# Altium schematic sheet DCPBoard.SchDoc: Digital Control Power Board for MiCore
size A4; DrawnBy: eleqian; Revision: 1.0; SheetNumber: 1; SheetTotal: 1
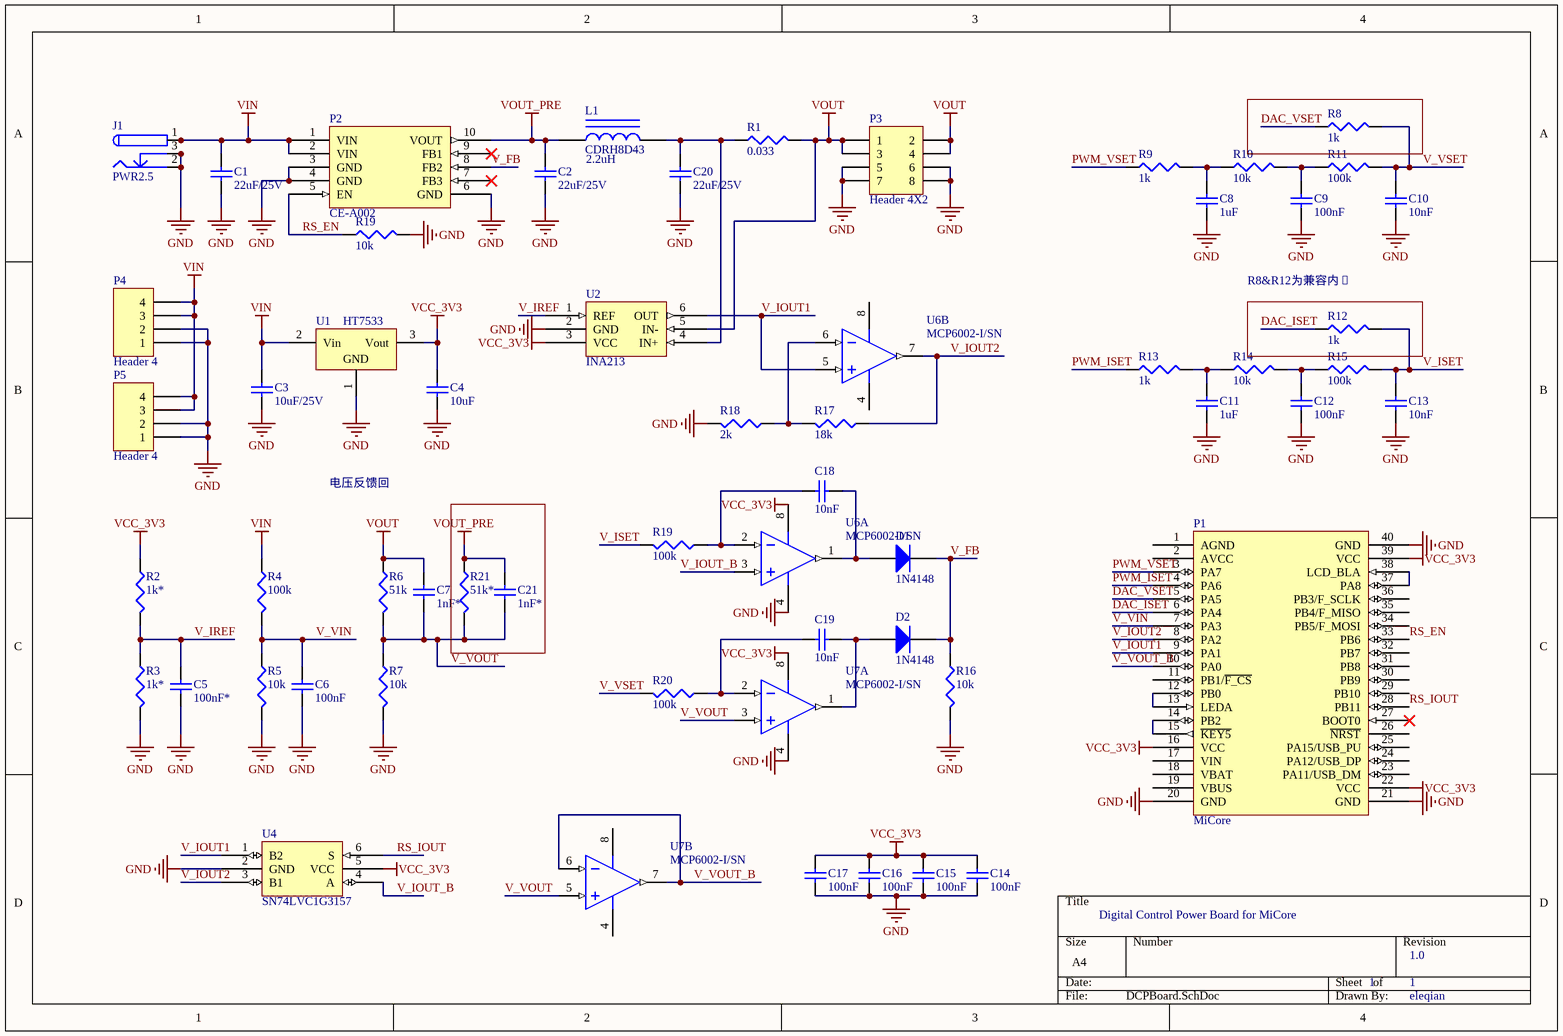
[diagram p0: DCPBoard.SchDoc]

## Parts
(Parts that share a designator on the sheet are numbered #1, #2 ... from top to bottom, then left to right.)
C1  value 22uF/25V  [1210C]  (hidden comment: Cap)
C2  value 22uF/25V  [1210C]  (hidden comment: Cap)
C3  value 10uF/25V  [1206C]  (hidden comment: Cap)
C4  value 10uF  [0805C]  (hidden comment: Cap)
C5  value 100nF*  [0603C]  (hidden comment: Cap)
C6  value 100nF  [0603C]  (hidden comment: Cap)
C7  value 1nF*  [0603C]  (hidden comment: Cap)
C8  value 1uF  [0603C]  (hidden comment: Cap)
C9  value 100nF  [0603C]  (hidden comment: Cap)
C10  value 10nF  [0603C]  (hidden comment: Cap)
C11  value 1uF  [0603C]  (hidden comment: Cap)
C12  value 100nF  [0603C]  (hidden comment: Cap)
C13  value 10nF  [0603C]  (hidden comment: Cap)
C14  value 100nF  [0603C]  (hidden comment: Cap)
C15  value 100nF  [0603C]  (hidden comment: Cap)
C16  value 100nF  [0603C]  (hidden comment: Cap)
C17  value 100nF  [0603C]  (hidden comment: Cap)
C18  value 10nF  [0603C]  (hidden comment: Cap)
C19  value 10nF  [0603C]  (hidden comment: Cap)
C20  value 22uF/25V  [1210C]  (hidden comment: Cap)
C21  value 1nF*  [0603C]  (hidden comment: Cap)
D1  1N4148  [0805D]
D2  1N4148  [0805D]
J1  PWR2.5  [DC-005]
L1  CDRH8D43  value 2.2uH  [INDP8080X45N]
P1  MiCore  [MICORE]
P2  CE-A002  [CE-A002]
P3  Header 4X2  [HDR2X4]
P4  Header 4  [HDR1X4]
P5  Header 4  [HDR1X4]
R1  value 0.033  [2010R]  (hidden comment: Res3)
R2  value 1k*  [0603R]  (hidden comment: Res3)
R3  value 1k*  [0603R]  (hidden comment: Res3)
R4  value 100k  [0603R]  (hidden comment: Res3)
R5  value 10k  [0603R]  (hidden comment: Res3)
R6  value 51k  [0603R]  (hidden comment: Res3)
R7  value 10k  [0603R]  (hidden comment: Res3)
R8  value 1k  [0603R]  (hidden comment: Res3)
R9  value 1k  [0603R]  (hidden comment: Res3)
R10  value 10k  [0603R]  (hidden comment: Res3)
R11  value 100k  [0603R]  (hidden comment: Res3)
R12  value 1k  [0603R]  (hidden comment: Res3)
R13  value 1k  [0603R]  (hidden comment: Res3)
R14  value 10k  [0603R]  (hidden comment: Res3)
R15  value 100k  [0603R]  (hidden comment: Res3)
R16  value 10k  [0603R]  (hidden comment: Res3)
R17  value 18k  [0603R]  (hidden comment: Res3)
R18  value 2k  [0603R]  (hidden comment: Res3)
R19#1  value 10k  [0603R]  (hidden comment: Res3)
R19#2  value 100k  [0603R]  (hidden comment: Res3)
R20  value 100k  [0603R]  (hidden comment: Res3)
R21  value 51k*  [0603R]  (hidden comment: Res3)
U1  HT7533  [SOT89N]
U2  INA213  [SOT-363-6N]
U4  SN74LVC1G3157  [SOT-363-6N]
U6  MCP6002-I/SN  [SOIC-SN8_N]  (parts A,B of 2)
U7  MCP6002-I/SN  [SOIC-SN8_N]  (parts A,B of 2)

## Blocks framed on the sheet
R8&R12为兼容内�: R12

## Nets
GND: C1.2 C2.2 C3.2 C4.2 C5.1 C6.1 C8.2 C9.2 C10.2 C11.2 C12.2 C13.2 C14.1 C15.1 C16.1 C17.1 C20.2 J1.2 J1.2A J1.2B J1.3 J1.3A J1.3B P1.20(GND) P1.21(GND) P1.40(GND) P2.3(GND) P2.4(GND) P2.6(GND) P3.5 P3.6 P3.7 P3.8 P4.1 P4.2 P5.1 P5.2 R3.2 R5.2 R7.2 R16.2 R18.2 R19#1.2 U1.1(GND) U2.2(GND) U4.2(GND) U6.4(VSS) U7.4(VSS)
VCC_3V3: C4.1 C14.2 C15.2 C16.2 C17.2 P1.16(VCC) P1.22(VCC) P1.39(VCC) R2.1 U1.3(Vout) U2.3(VCC) U4.5(VCC) U6.8(VDD) U7.8(VDD)
VIN: C1.1 C3.1 J1.1 J1.1A J1.1B P2.1(VIN) P2.2(VIN) P4.3 P4.4 P5.3 P5.4 R4.1 U1.2(Vin)
VOUT: C7.2 P3.1 P3.2 P3.3 P3.4 R1.2 R6.1 U2.5(IN-)
VOUT_PRE: C2.1 C21.2 L1.1 P2.10(VOUT) R21.1
DAC_ISET: P1.6(PA4) R12.1
DAC_VSET: P1.5(PA5) R8.1
PWM_ISET: P1.4(PA6) R13.1
PWM_VSET: P1.3(PA7) R9.1
RS_EN: P1.33(PB6) P2.5(EN) R19#1.1
RS_IOUT: P1.28(PB11) U4.6(S)
V_FB: D1.2(K) D2.2(K) P2.8(FB2) R16.1
V_IOUT1: P1.9(PA1) U2.6(OUT) U4.1(B2) U6.5(VINB+)
V_IOUT2: P1.8(PA2) R17.1 U4.3(B1) U6.7(VOUTB)
V_IOUT_B: U4.4(A) U6.3(VINA+)
V_IREF: C5.2 R2.2 R3.1 U2.1(REF)
V_ISET: C13.1 R12.2 R15.2 R19#2.2
V_VIN: C6.2 P1.7(PA3) R4.2 R5.1
V_VOUT: C7.1 C21.1 R6.2 R7.1 R21.2 U7.3(VINA+) U7.5(VINB+)
V_VOUT_B: P1.10(PA0) U7.6(VINB-) U7.7(VOUTB)
V_VSET: C10.1 R8.2 R11.2 R20.2
NetC8_1: C8.1 R9.2 R10.1
NetC9_1: C9.1 R10.2 R11.1
NetC11_1: C11.1 R13.2 R14.1
NetC12_1: C12.1 R14.2 R15.1
NetC18_1: C18.1 R19#2.1 U6.2(VINA-)
NetC18_2: C18.2 D1.1(A) U6.1(VOUTA)
NetC19_1: C19.1 R20.1 U7.2(VINA-)
NetC19_2: C19.2 D2.1(A) U7.1(VOUTA)
NetC20_1: C20.1 L1.2 R1.1 U2.4(IN+)
NetP1_12: P1.12(PB0) P1.13(LEDA)
NetP1_14: P1.14(PB2) P1.15(~{KEY5})
NetP1_37: P1.37(PA8) P1.38(LCD_BLA)
NetR17_2: R17.2 R18.1 U6.6(VINB-)

Not connected (* = marked no-connect by the designer): P1 1(AGND) 2(AVCC) 11(PB1/~{F_CS}) 17(VIN) 18(VBAT) 19(VBUS) 23(PA11/USB_DM) 24(PA12/USB_DP) 25(PA15/USB_PU) 26(~{NRST}) 27(BOOT0)* 29(PB10) 30(PB9) 31(PB8) 32(PB7) 34(PB5/F_MOSI) 35(PB4/F_MISO) 36(PB3/F_SCLK); P2 7(FB3)* 9(FB1)*

## Notes on the sheet
- 电压反馈回

## Library data of the parts
C1-C21 = Cap: Capacitor; Published: 8-Jun-2000; LatestRevisionDate: 17-Jul-2002; LatestRevisionNote: Re-released for DXP Platform.; PackageReference: RAD-0.3; Publisher: Altium Limited
  C5-C19 C21: PackageDescription: Radial Cap, Thru-Hole; 2 Leads; 0.3 in Pin Spacing
D1 D2 = Diode 1N4148: High Conductance Fast Diode; Published: 8-Jun-2000; LatestRevisionDate: 17-Jul-2002; LatestRevisionNote: Re-released for DXP Platform.; DatasheetVersion: 1997; PackageReference: DO-35; Publisher: Altium Limited; PackageDescription: Diode, Axial; Body 3.8 x 1.9 mm (LxDia. max), Lead Dia. 0.53 mm (max); Code_JEDEC: DO-204-AH; ComponentLink1Description: Manufacturer Link; ComponentLink1URL: http://www.fairchildsemi.com/; ComponentLink2Description: Datasheet; ComponentLink2URL: http://www.fairchildsemi.com/ds/1N%2F1N4148.pdf
J1 = PWR2.5: Low Voltage Power Supply Connector; pin to pad: 1A>1 1B>1 2A>2 2B>2 3A>3 3B>3; Published: 17-Dec-2003; DatasheetDocument: 09-May-2002; Publisher: Altium Limited; ComponentLink1Description: Manufacturer Link; ComponentLink1URL: http://domino.kycon.com/internet/Products.html
L1 = Inductor Iron: Magnetic-Core Inductor; Published: 24-Mar-1999; LatestRevisionDate: 17-Jul-2002; LatestRevisionNote: Re-released for DXP Platform.; PackageReference: AXIAL-0.9; Publisher: Altium Limited; PackageDescription: Axial Device, Thru-Hole; 2 Leads; 0.9 in Pin Spacing
P1 = MiCore: MiCore核心板
P2 = CE-A: DC-DC模块
P3 = Header 4X2: Header, 4-Pin, Dual row; LatestRevisionDate: 17-Jul-2002; LatestRevisionNote: Re-released for DXP Platform.; Publisher: Altium Limited
P4 P5 = Header 4: Header, 4-Pin; LatestRevisionDate: 17-Jul-2002; LatestRevisionNote: Re-released for DXP Platform.; Publisher: Altium Limited
R1-R18 R19#1 R19#2 R20 R21 = Res3: Resistor; Published: 8-Jun-2000; LatestRevisionDate: 29-May-2009; LatestRevisionNote: IPC-7351 Footprint Added.; PackageReference: J1-0603; Publisher: Altium Limited; PackageDescription: Chip Resistor
U1 = HT7: 3.3V稳压
U2 = I: 电流并联测量
U4 = SN74: SPDT模拟开关
U6 U7 = MCP6002-I/SN: 1 MHz, Low-Power Operational Amplifier, 8-Pin SOIC, Industrial Temperature; Published: 29-Jan-2009; LatestRevisionDate: 02-Dec-2009; LatestRevisionNote: Updated to datasheet revision J, Nov-2009; DatasheetVersion: revJ, Nov-2009; PackageVersion: revBB, Aug-2009; PackageReference: SOIC-SN8; Publisher: Altium Limited; PackageDescription: 8-Lead Plastic Small Outline (SN) - Narrow, 3.90mm Body [SOIC]; Supplier 1: Digi-Key; Supplier Part Number 1: MCP6002-I/SN-ND; Supplier 2: Farnell; Supplier Part Number 2: 1292246; Code_JEDEC: MS-012; Code_IPC: SOIC127P600-8; ComponentLink1Description: Datasheet; ComponentLink1URL: http://ww1.microchip.com/downloads/en/DeviceDoc/21733j.pdf; ComponentLink2Description: Packaging Specification; ComponentLink2URL: http://www.microchip.com/stellent/groups/techpub_sg/documents/packagingspec/en012702.pdf; ComponentLink3Description: Microchip.com Home; ComponentLink3URL: http://www.microchip.com/